# Altium schematic sheet ControlBoard2.SchDoc
size Legal
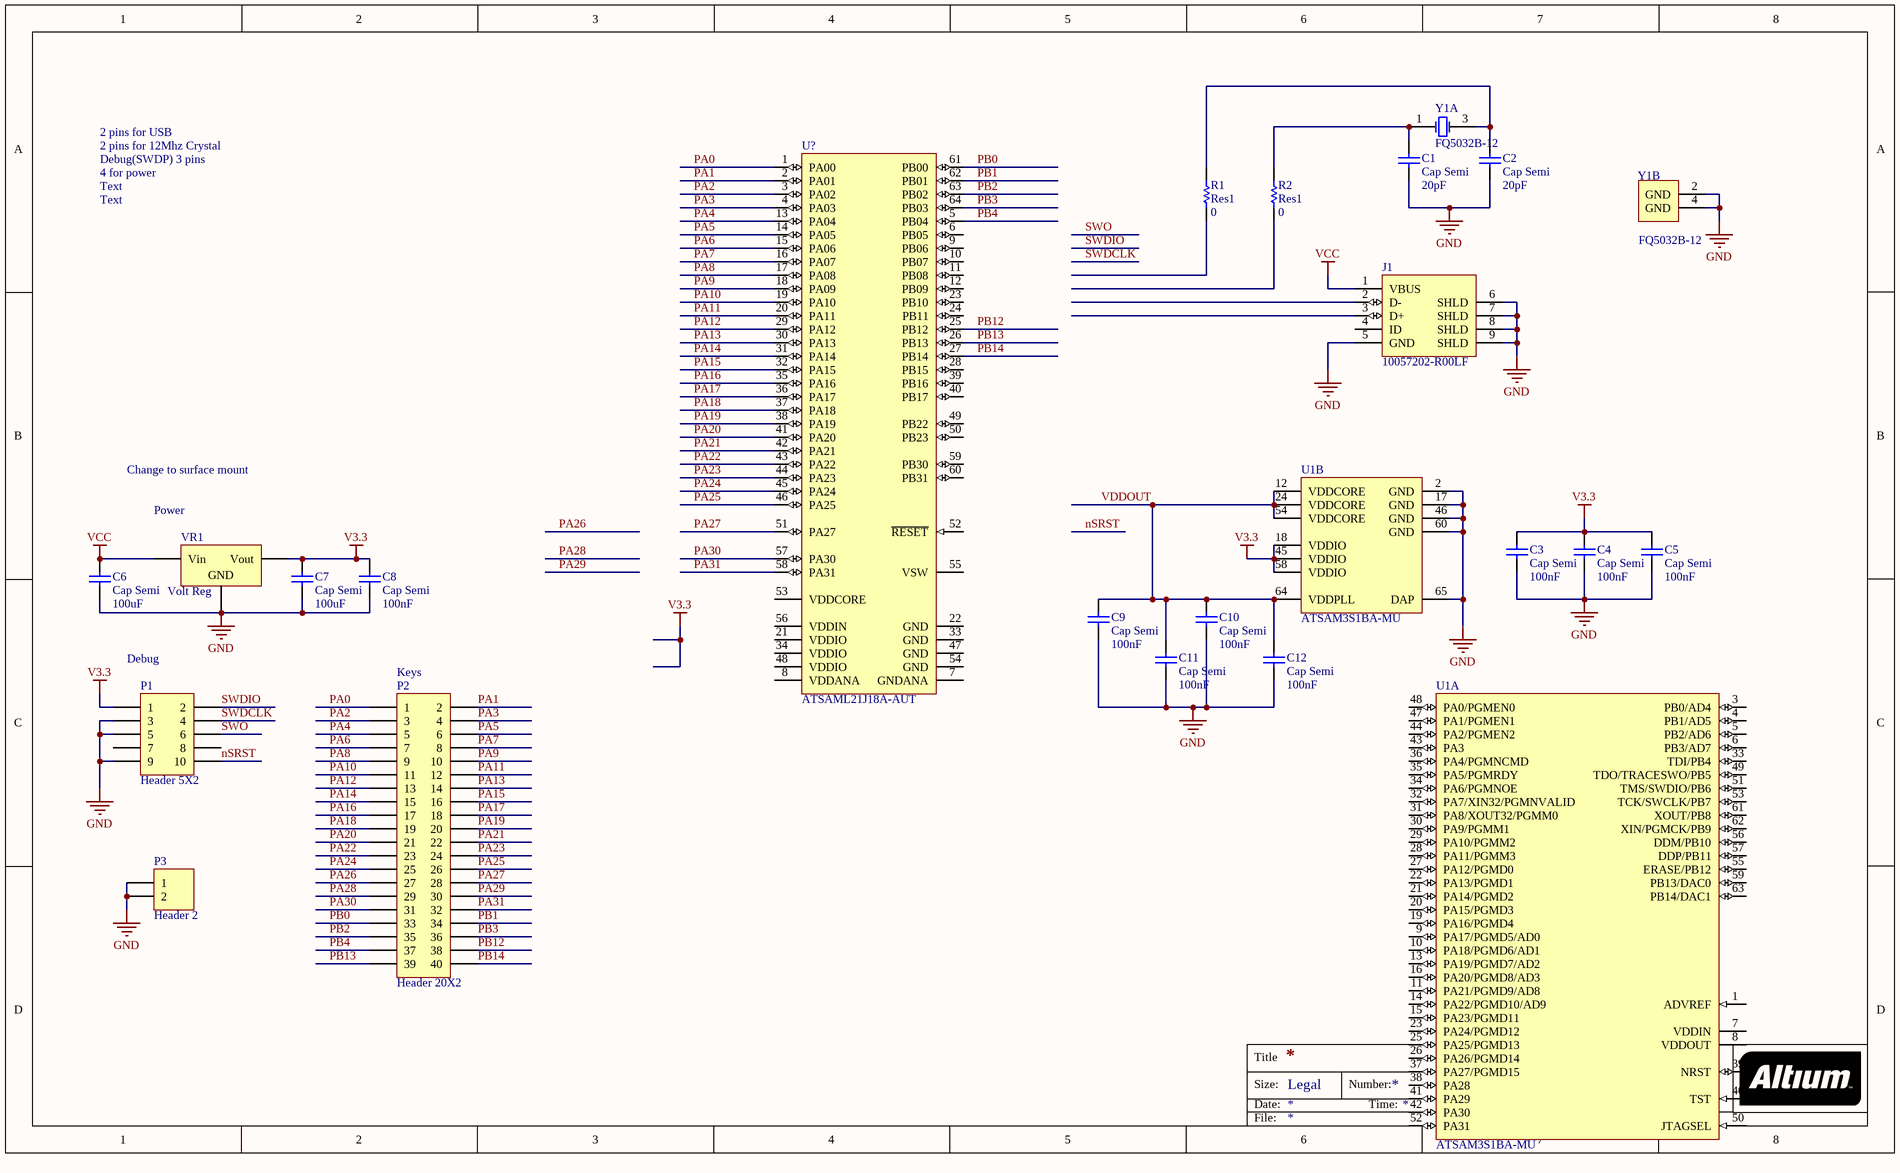
[diagram p0: ControlBoard2.SchDoc]

## Parts
C1  Cap Semi  value 20pF  [C2512]
C2  Cap Semi  value 20pF  [C2512]
C3  Cap Semi  value 100nF  [C1206]
C4  Cap Semi  value 100nF  [C1206]
C5  Cap Semi  value 100nF  [C1206]
C6  Cap Semi  value 100uF  [C2512]
C7  Cap Semi  value 100uF  [C2512]
C8  Cap Semi  value 100nF  [C2512]
C9  Cap Semi  value 100nF  [C1206]
C10  Cap Semi  value 100nF  [C1206]
C11  Cap Semi  value 100nF  [C1206]
C12  Cap Semi  value 100nF  [C1206]
J1  10057202-R00LF  [FCI-10057202-R00LF_V]
P1  Header 5X2  [HDR2X5]
P2  Header 20X2  [HDR2X20]
P3  Header 2  [HDR1X2]
R1  Res1  value 0  [6-0805_M]
R2  Res1  value 0  [6-0805_M]
U1  ATSAM3S1BA-MU  [QFN64_M]  (parts A,B of 2)
U?  ATSAML21J18A-AUT  [TQFP64_N]
VR1  Volt Reg  [D2PAK_M]
Y1  FQ5032B-12  [FOX-FQ5032B_V]  (parts A,B of 2)

## Nets
GND: C1.1 C2.1 C3.1 C4.1 C5.1 C6.1 C7.1 C8.1 C9.1 C10.1 C11.1 C12.1 J1.5(GND) J1.6(SHLD) J1.7(SHLD) J1.8(SHLD) J1.9(SHLD) P1.3 P1.5 P1.9 P3.1 P3.2 U1.2(GND) U1.17(GND) U1.46(GND) U1.60(GND) U1.65(DAP) VR1.2(GND) Y1.2(GND) Y1.4(GND)
V3.3: C3.2 C4.2 C5.2 C7.2 C8.2 P1.1 U1.18(VDDIO) U1.45(VDDIO) U1.58(VDDIO) VR1.3(Vout)
VCC: C6.2 J1.1(VBUS) VR1.1(Vin)
nSRST: P1.10
PA0: P2.1 U?.1(PA00)
PA1: P2.2 U?.2(PA01)
PA2: P2.3 U?.3(PA02)
PA3: P2.4 U?.4(PA03)
PA4: P2.5 U?.13(PA04)
PA5: P2.6 U?.14(PA05)
PA6: P2.7 U?.15(PA06)
PA7: P2.8 U?.16(PA07)
PA8: P2.9 U?.17(PA08)
PA9: P2.10 U?.18(PA09)
PA10: P2.11 U?.19(PA10)
PA11: P2.12 U?.20(PA11)
PA12: P2.13 U?.29(PA12)
PA13: P2.14 U?.30(PA13)
PA14: P2.15 U?.31(PA14)
PA15: P2.16 U?.32(PA15)
PA16: P2.17 U?.35(PA16)
PA17: P2.18 U?.36(PA17)
PA18: P2.19 U?.37(PA18)
PA19: P2.20 U?.38(PA19)
PA20: P2.21 U?.41(PA20)
PA21: P2.22 U?.42(PA21)
PA22: P2.23 U?.43(PA22)
PA23: P2.24 U?.44(PA23)
PA24: P2.25 U?.45(PA24)
PA25: P2.26 U?.46(PA25)
PA26: P2.27
PA27: P2.28 U?.51(PA27)
PA28: P2.29
PA29: P2.30
PA30: P2.31 U?.57(PA30)
PA31: P2.32 U?.58(PA31)
PB0: P2.33 U?.61(PB00)
PB1: P2.34 U?.62(PB01)
PB2: P2.35 U?.63(PB02)
PB3: P2.36 U?.64(PB03)
PB4: P2.37 U?.5(PB04)
PB12: P2.38 U?.25(PB12)
PB13: P2.39 U?.26(PB13)
PB14: P2.40 U?.27(PB14)
SWDCLK: P1.4
SWDIO: P1.2
SWO: P1.6
VDDOUT: C9.2 C10.2 C11.2 C12.2 U1.12(VDDCORE) U1.24(VDDCORE) U1.54(VDDCORE) U1.64(VDDPLL)
NetC1_2: C1.2 R2.2 Y1.1(X1)
NetC2_2: C2.2 R1.2 Y1.3(X2)

Not connected (* = marked no-connect by the designer): J1 2(D-) 3(D+) 4(ID); P1 7 8; R1 1; R2 1; U1 1(ADVREF) 3(PB0/AD4) 4(PB1/AD5) 5(PB2/AD6) 6(PB3/AD7) 7(VDDIN) 8(VDDOUT) 9(PA17/PGMD5/AD0) 10(PA18/PGMD6/AD1) 11(PA21/PGMD9/AD8) 13(PA19/PGMD7/AD2) 14(PA22/PGMD10/AD9) 15(PA23/PGMD11) 16(PA20/PGMD8/AD3) 19(PA16/PGMD4) 20(PA15/PGMD3) 21(PA14/PGMD2) 22(PA13/PGMD1) 23(PA24/PGMD12) 25(PA25/PGMD13) 26(PA26/PGMD14) 27(PA12/PGMD0) 28(PA11/PGMM3) 29(PA10/PGMM2) 30(PA9/PGMM1) 31(PA8/XOUT32/PGMM0) 32(PA7/XIN32/PGMNVALID) 33(TDI/PB4) 34(PA6/PGMNOE) 35(PA5/PGMRDY) 36(PA4/PGMNCMD) 37(PA27/PGMD15) 38(PA28) 39(NRST) 40(TST) 41(PA29) 42(PA30) 43(PA3) 44(PA2/PGMEN2) 47(PA1/PGMEN1) 48(PA0/PGMEN0) 49(TDO/TRACESWO/PB5) 50(JTAGSEL) 51(TMS/SWDIO/PB6) 52(PA31) 53(TCK/SWCLK/PB7) 55(ERASE/PB12) 56(DDM/PB10) 57(DDP/PB11) 59(PB13/DAC0) 61(XOUT/PB8) 62(XIN/PGMCK/PB9) 63(PB14/DAC1); U? 6(PB05) 7(GNDANA) 8(VDDANA) 9(PB06) 10(PB07) 11(PB08) 12(PB09) 21(VDDIO) 22(GND) 23(PB10) 24(PB11) 28(PB15) 33(GND) 34(VDDIO) 39(PB16) 40(PB17) 47(GND) 48(VDDIO) 49(PB22) 50(PB23) 52(~{RESET}) 53(VDDCORE) 54(GND) 55(VSW) 56(VDDIN) 59(PB30) 60(PB31)

## Notes on the sheet
- 2 pins for USB
- 2 pins for 12Mhz Crystal
- Debug(SWDP) 3 pins
- 4 for power
- Text
- Change to surface mount
- (near VR1) Power
- (near P1) Debug
- (near P2) Keys
- Title
- Size:
- Date:
- Legal
- Number:
- Time:
- Revision:
- Sheet
- of
- File:

## Library data of the parts
C1-C12 = Cap Semi: Capacitor (Semiconductor SIM Model); Published: 8-Jun-2000; LatestRevisionDate: 29-May-2009; LatestRevisionNote: IPC-7351 Footprint Added.; PackageReference: C1206; Publisher: Altium Limited; PackageDescription: Chip Capacitor
J1 = CMP-0397-00001-1: Connector Mini USB, Right Angle, Receptacle, Type B; Manufacturer: FCI Electronics; ComponentLink1URL: http://portal.fciconnect.com/; DatasheetVersion: Rev. A, 12/2006; Mounting Technology: Surface Mount; ComponentLink1Description: Manufacturer URL; ComponentLink2Description: Datasheet; ComponentLink2URL: http://portal.fciconnect.com/Comergent//fci/documentation/gs-12-421.pdf; PartNumber: 10057202-R00LF; PackageReference: 10057202-R00LF; PackageDescription: Connector, USB Mini-B, Sinking Type, SMT, 5 Position, Right Angle
P1 = Header 5X2: Header, 5-Pin, Dual row; LatestRevisionDate: 17-Jul-2002; LatestRevisionNote: Re-released for DXP Platform.; Publisher: Altium Limited
P2 = Header 20X2: Header, 20-Pin, Dual row; LatestRevisionDate: 17-Jul-2002; LatestRevisionNote: Re-released for DXP Platform.; Publisher: Altium Limited
P3 = Header 2: Header, 2-Pin; LatestRevisionDate: 17-Jul-2002; LatestRevisionNote: Re-released for DXP Platform.; Publisher: Altium Limited
R1 R2 = Res1: Resistor; Published: 8-Jun-2000; LatestRevisionDate: 17-Jul-2002; LatestRevisionNote: Re-released for DXP Platform.; PackageReference: AXIAL-0.3; Publisher: Altium Limited; PackageDescription: Axial Device, Thru-Hole; 2 Leads; 0.3 in Pin Spacing
U1 = CMP-0076-00048-1: AT91 ARM Cortex-M3 32-bit Microcontroller, 64KB Flash, 16KB ROM, 10-ch. ADC, 47 User I/Os, 64-Pin QFN, Industrial Grade (-40°C to 85°C), Pb-Free; PackageReference: QFN64; PackageDescription: 64-Pin Quad Flat No-Lead 0.5 mm Pitch; DatasheetVersion: revA, Dec-2009; Code_JEDEC: MO-220; PackageVersion: Apr-2006
U? = CMP-0076-00206-1: SMART ARM-based Microcontroller, 1.62 to 3.63 V, 256 KB Flash, 32 KB SRAM, -40 to 85 degC, 64-Pin TQFP, Tape and Reel; Manufacturer: Atmel; Flash Memory Density: 256 KB; CPU Frequency: 48 MHz Max.; GPIOs: 51; System SRAM: 32 KB; Temperature Range: -40 to 85 degC; PackageReference: TQFP-64; DatasheetVersion: Rev. B; ComponentLink2Description: Datasheet; PackageDescription: 64-Pin Thin Quad Flat Pack, Body 10 x 10 mm, Pitch 0.5 mm; ComponentLink1Description: Manufacturer URL; PartNumber: ATSAML21J18A-AUT; ComponentLink3URL: http://www.atmel.com/Images/Atmel-42385-SAM-L21_Summary.pdf; Packing: Tape and Reel; ComponentLink2URL: http://www.atmel.com/Images/Atmel-42385-SAM-L21_Summary.pdf; Mounting Technology: Surface Mount; ComponentLink1URL: www.atmel.com; Operating Voltage: 1.62 to 3.63 V; ComponentLink3Description: Package Specification
VR1 = Volt Reg: Voltage Regulator; Published: 24-Mar-1999; LatestRevisionDate: 29-May-2009; LatestRevisionNote: IPC-7351 Footprint Added.; PackageReference: D2PAK; Publisher: Altium Limited; PackageDescription: 3-Pin Transistor Outline Package 2.54 mm Pitch, 15.1 mm Lead Span
Y1 = CMP-0399-00001-1: Crystal, SMD, 12MHz, Stab=30ppm 20.0pF; Manufacturer: FOX Electronics; Frequency Tolerance: 30 ppm; Mounting Technology: Surface Mount; PackageReference: FQ5032B; DatasheetVersion: Mar-10; ComponentLink1URL: http://www.foxonline.com/; Nominal Frequency: 12 MHz; ComponentLink1Description: Manufacturer URL; Storage Temperature: -40 to 85 degC; PackageDescription: 4-Pin SMT Crystal, 5.2 x 3.4 mm Body; ComponentLink2Description: Datasheet; PartNumber: FQ5032B-12; ComponentLink2URL: http://www.foxonline.com/pdfs/fq5032.pdf